# EasyEDA Pro project 8CH_ADC_CAPTURE_CARD.epro, board 8CH_ADC_CARD_V1.3
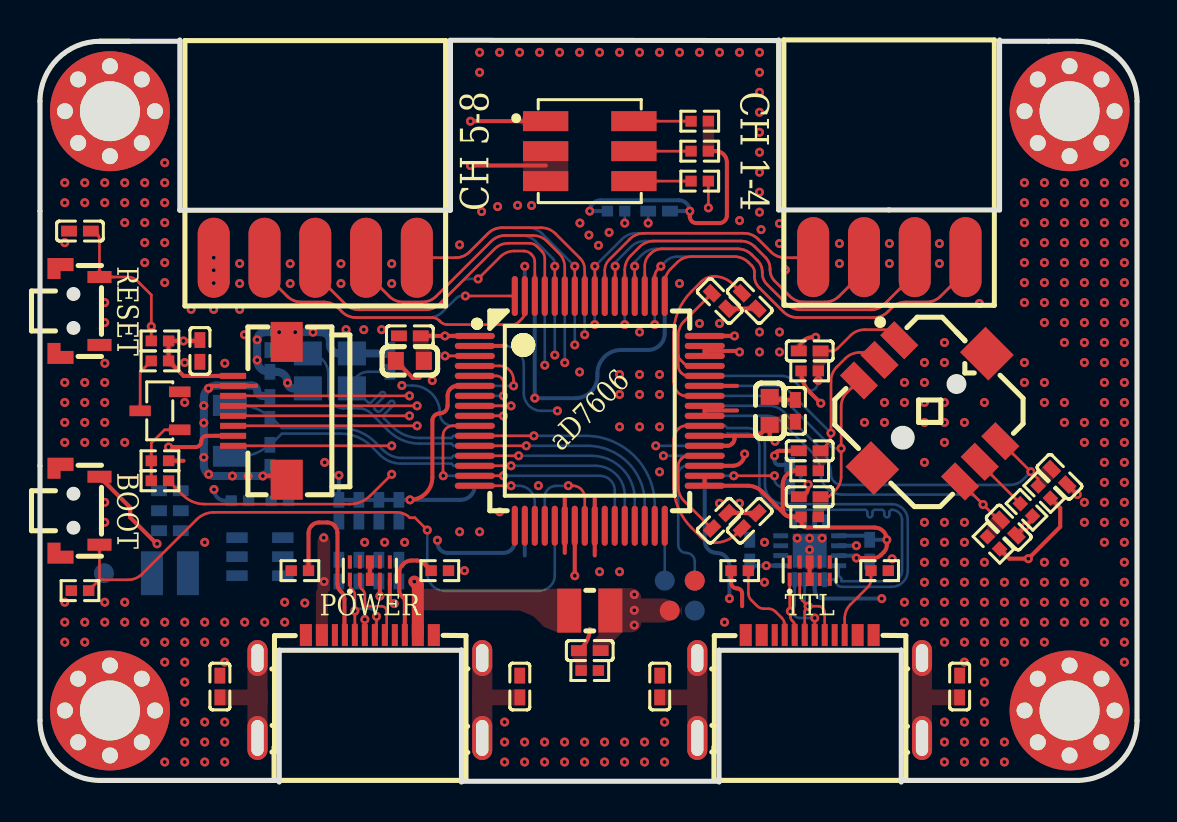
[diagram p10: board, top side]
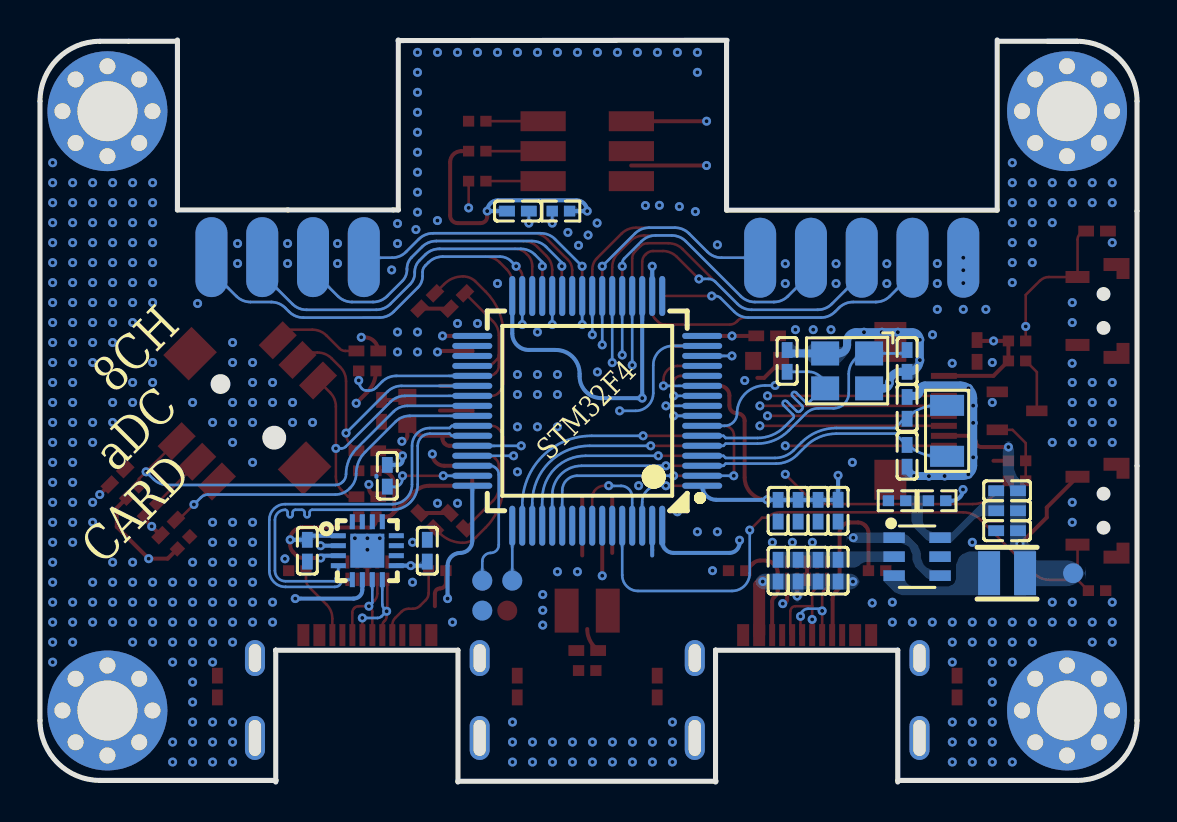
[diagram p11: board, bottom side, seen from below]

Outline 54.87 x 37.15 mm; copper layers: Top Layer, Inner1, Inner2, Bottom Layer. Coordinates in mm from the lower left corner of the outline.
Outline path: 3,37.08 arc(0.88,36.2) 0,34.08 0,3.08 arc(0.88,0.96) 3,0.08 11.97,0.08 ; 3,37.08 4.48,37.08 ; 3,37.08 6.96,37.08 ; 33.97,0.04 21.06,0.04 ; 36.96,37.12 20.5,37.13 ; 48.01,37.08 51.87,37.08 arc(53.99,36.2) 54.87,34.08 54.87,3.08 arc(53.99,0.96) 51.87,0.08 43.06,0.08
Stack: Top Layer 0.035mm 外层铜厚1oz / Dielectric1 0.2104mm 7628 RC49% 8.6mil / Inner1 0.0152mm 内层铜厚 / Dielectric2 1.065mm 1.1mm H/HOZ 含铜 / Inner2 0.0152mm 内层铜厚 / Dielectric3 0.2104mm 7628 RC49% 8.6mil / Bottom Layer 0.035mm 外层铜厚1oz

## Design rules (mm)
net RXD: DP1
net TXD: DP1
net OSC_IN: DP3
net OSC_OUT: DP3
net OSC_32_IN: DP2
net OSC_32_OUT: DP2
net OTG_D+: DP4
net OTG_D-: DP4
template: 自定义配置
spacing copperThickness1oz (default): track to track 0.102, other pairs 0.152 to 0.3
spacing copperThickness2oz: track to track 0.203, other pairs 0.152 to 0.3
spacing SIGNAL: track to track 0.26, other pairs 0.152 to 0.3
track width copperThickness1oz (default): min 0.127, default 0.254, max 2.54
track width copperThickness2oz: min 0.203, default 0.254, max 2.54
track width ADC_CH: min 0.13, default 0.13, max 0.13
track width POWER: min 0.2, default 0.3, max 1
track width SIGNAL: min 0.13, default 0.13, max 0.13
differential pair differentialPair (default): width min 0.127, default 0.254, max 2.54; gap min 0.152, default 0.152
via viaSize (default): diameter min 0.45, default 0.45, max 0.45; hole min 0.2, default 0.2, max 0.2
net NRST uses SIGNAL
net BOOT0 uses SIGNAL
net IPS_SDA uses SIGNAL
net IPS_SCL uses SIGNAL
net DVCC uses POWER
net DGND uses POWER
net IPS_BL uses SIGNAL
net AGND uses POWER
net AVCC uses POWER
net AGND_CH0 uses SIGNAL
net ADC_CH0 uses ADC_CH, SIGNAL
net AGND_CH1 uses SIGNAL
net AGND_CH2 uses SIGNAL
net AGND_CH3 uses SIGNAL
net AGND_CH4 uses SIGNAL
net AGND_CH5 uses SIGNAL
net AGND_CH6 uses SIGNAL
net ADC_CH6 uses ADC_CH, SIGNAL
net AGND_CH7 uses SIGNAL
net ADC_CH7 uses ADC_CH, SIGNAL
net ADC_CH5 uses ADC_CH, SIGNAL
net ADC_CH4 uses ADC_CH, SIGNAL
net ADC_CH3 uses ADC_CH, SIGNAL
net ADC_CH2 uses ADC_CH, SIGNAL
net ADC_CH1 uses ADC_CH, SIGNAL
net ADC_RESET uses SIGNAL
net ADC_CONVST_B uses SIGNAL
net ADC_CONVST_A uses SIGNAL
net ADC_RANGE uses SIGNAL
net ADC_OS2 uses SIGNAL
net ADC_OS1 uses SIGNAL
net ADC_OS0 uses SIGNAL
net IPS_CS uses SIGNAL
net ADC_DB7 uses SIGNAL
net ADC_DB0 uses SIGNAL
net ADC_FRSTDATA uses SIGNAL
net ADC_BUSY uses SIGNAL
net ADC_CS uses SIGNAL
net ADC_RD uses SIGNAL
net RXD uses SIGNAL
net TXD uses SIGNAL
net TTL_D+ uses SIGNAL
net TTL_D- uses SIGNAL
net OSC_IN uses SIGNAL
net OSC_OUT uses SIGNAL
net OSC_32_IN uses SIGNAL
net OSC_32_OUT uses SIGNAL
net UP uses SIGNAL
net PRRESS uses SIGNAL
net LEFT uses SIGNAL
net DOWN uses SIGNAL
net RIGHT uses SIGNAL
net OTG_D+ uses SIGNAL
net OTG_D- uses SIGNAL
net USER uses SIGNAL
net IPS_RESET uses SIGNAL
net IPS_DC uses SIGNAL
net VCC_POWER uses POWER
net SWCLK uses SIGNAL
net SWDIO uses SIGNAL

## Placement (name value [footprint] x y rotation side)
C34  100nF  [C0402]  2 27.58 0 top
C58  12pF  [C0402]  11.5 16.33 90 bottom
C59  12pF  [C0402]  11.5 18.73 270 bottom
C60  10pF  [C0402]  11.5 21.08 270 bottom
C61  10pF  [C0402]  17.5 21.08 270 bottom
C65  100nF  [C0402]  24 4.78 270 top
C72  100nF  [C0402]  38.5 21.58 180 top
C81  4.7uF  [C0402]  30.97 28.58 180 bottom
C103  100nF  [C0402]  8 21.58 270 top
C104  1uF  [C0402]  34 13.08 45 top
C105  1uF  [C0402]  35.5 13.08 45 top
C106  1uF  [C0402]  35.5 24.08 315 top
C107  10uF  [C0402]  34 24.08 315 top
C108  100nF  [C0402]  46 4.78 270 top
C121  100nF  [C0603]  36.5 18.58 270 top
C122  4.7uF  [C0402]  18.5 22.34 0 top
C124  100nF  [C0603]  18.5 21.08 0 top
C130  4.7uF  [C0402]  14.95 13.58 90 bottom
C133  100nF  [C0402]  51 15.28 315 top
C134  100nF  [C0402]  38.5 14.28 180 top
C135  100nF  [C0402]  48.46 12.74 135 top
C136  100nF  [C0402]  38.5 16.58 0 top
C137  4.7uF  [C0402]  37.5 15.33 90 bottom
C138  100nF  [C0402]  35.5 11.58 90 bottom
C139  100nF  [C0402]  41.5 11.58 270 bottom
C151  100nF  [C0402]  14.95 10.58 270 bottom
C152  100nF  [C0402]  15.95 10.58 270 bottom
C153  100nF  [C0402]  16.95 10.58 270 bottom
C154  4.7uF  [C0402]  17.95 10.58 270 bottom
C155  10uF  [C0402]  6.5 12.58 180 bottom
C156  22uF  [C0402]  6.5 14.58 180 bottom
C157  22uF  [C0402]  6.5 13.58 180 bottom
C158  100nF  [C0402]  27.5 6.58 0 top
C165  100nF  [C0402]  15.95 13.58 270 bottom
C166  100nF  [C0402]  16.95 13.58 270 bottom
C167  100nF  [C0402]  17.95 13.58 270 bottom
C168  4.7uF  [C0402]  37.79 18.58 270 top
C169  100nF  [C0402]  9 4.78 270 top
C170  100nF  [C0402]  31 4.78 270 top
FPC1  AFC01-S08FCA-00  [FPC-SMD_P0.50-8P_FGS-XJ-H2.0]  11 18.58 270 top
L1  10uH  [IND-SMD_L2.5-W2.0]  27.5 8.58 0 top
LED6  TC5050RGBF08-3CJH-AF53A  [led-smd_6p-l5.0-w5.0-tl_tc5050rgbf08]  27.5 31.58 0 top
NOREF  -  [Pad_e127]  5.09 5.17 45 top
NOREF#2  -  [Pad_e116]  51.5 31.33 45 top
NOREF#3  -  [Pad_e123]  49.91 1.99 45 top
NOREF#4  -  [Pad_e46]  3.5 31.33 45 top
NOREF#5  -  [Pad_e120]  51.5 5.83 45 top
NOREF#6  -  [Pad_e121]  49.91 5.17 45 top
NOREF#7  -  [Pad_e114]  49.25 33.58 45 top
NOREF#8  -  [Pad_e111]  51.5 35.83 45 top
NOREF#9  -  [Pad_e115]  49.91 31.99 45 top
NOREF#10  -  [Pad_e49]  5.09 31.99 45 top
NOREF#11  -  [Pad_e118]  53.75 3.58 45 top
NOREF#12  -  [Pad_e119]  53.09 5.17 45 top
NOREF#13  -  [Pad_e63]  53.75 33.58 45 top
NOREF#14  -  [Pad_e138]  51.5 3.58 0 top
NOREF#15  -  [Pad_e135]  3.5 1.33 45 top
NOREF#16  -  [Pad_e51]  3.5 35.83 45 top
NOREF#17  -  [Pad_e129]  1.91 5.17 45 top
NOREF#18  -  [Pad_e126]  5.75 3.58 45 top
NOREF#19  -  [Pad_e137]  3.5 3.58 0 top
NOREF#20  -  [Pad_e58]  1.91 35.17 45 top
NOREF#21  -  [Pad_e124]  51.5 1.33 45 top
NOREF#22  -  [Pad_e136]  51.5 33.58 0 top
NOREF#23  -  [Pad_e128]  3.5 5.83 45 top
NOREF#24  -  [Pad_e47]  1.25 33.58 45 top
NOREF#25  -  [Pad_e132]  1.91 1.99 45 top
NOREF#26  -  [Pad_e130]  1.25 3.58 45 top
NOREF#27  -  [Pad_e117]  53.09 31.99 45 top
NOREF#28  -  [Pad_e43]  1.91 31.99 45 top
NOREF#29  -  [Pad_e60]  5.75 33.58 45 top
NOREF#30  -  [Pad_e113]  49.91 35.17 45 top
NOREF#31  -  [Pad_e122]  49.25 3.58 45 top
NOREF#32  -  [Pad_e134]  3.5 33.58 0 top
NOREF#33  -  [Pad_e139]  5.09 1.99 45 top
NOREF#34  -  [Pad_e64]  53.09 35.17 45 top
NOREF#35  -  [Pad_e48]  5.09 35.17 45 top
NOREF#36  -  [Pad_e125]  53.09 1.99 45 top
Q1  S8050  [SOT-23-3_L2.9-W1.3-P1.90-LS2.3-BR]  6 18.58 0 top
R18  10kΩ  [R0402]  2 9.58 180 top
R20  10kΩ  [R0402]  6 22.08 0 top
R77  5.1kΩ  [R0402]  13 10.58 180 top
R78  5.1kΩ  [R0402]  20 10.58 0 top
R79  100Ω  [R0402]  49.34 13.63 135 top
R84  680Ω  [R0402]  33 33.08 0 top
R97  10Ω  [R0402]  6 21.08 0 top
R101  5.1kΩ  [R0402]  35 10.58 180 top
R102  5.1kΩ  [R0402]  42 10.58 0 top
R103  680Ω  [R0402]  33 31.58 0 top
R104  680Ω  [R0402]  33 30.08 0 top
R106  10kΩ  [R0402]  38.5 20.58 180 top
R107  10kΩ  [R0402]  50.23 14.52 315 top
R108  10kΩ  [R0402]  38.5 13.28 180 top
R109  10kΩ  [R0402]  47.69 11.98 315 top
R110  10kΩ  [R0402]  38.5 15.58 180 top
R111  10kΩ  [R0402]  28.82 28.58 180 bottom
R112  0Ω  [R0402]  27.5 5.58 0 top
R113  910kΩ  [R0402]  10 14.08 180 bottom
R114  200kΩ  [R0402]  12 14.08 180 bottom
R115  4.7kΩ  [R0402]  6 15.08 0 top
R116  3.3kΩ  [R0402]  6 16.08 180 top
SW4  TM-4175-B-B  [SW-SMD_TM-4175-B-X]  44.5 18.58 315 top
SW5  TS24CA  [SW-SMD_TS24CA]  2 23.58 90 top
SW6  TS24CA  [SW-SMD_TS24CA]  2 13.58 90 top
U20  CH343P  [TQFN-16_L3.0-W3.0-P0.50-BL-EP1.7]  38.5 11.58 270 bottom
U27  TLV62569PDDCR  [SOT-23-6_L2.9-W1.6-P0.95-LS2.8-BL]  11 11.28 270 bottom
U29  AD7606BSTZ  [LQFP-64_L10.0-W10.0-P0.50-LS12.0-BL]  27.5 18.58 270 top
U33  2.54-2*4  [HDR-TH_8P-P2.54-V-F-R2-C4-S2.54]  42.49 26.28 0 top
U35  STM32F405RGT6  [LQFP-64_L10.0-W10.0-P0.50-LS12.0-BL]  27.5 18.58 90 bottom
U37  RCLAMP0524P-ES  [DFN2510-10_L2.5-W1.0-P0.50-BL]  16.5 10.58 0 top
U38  RCLAMP0524P-ES  [DFN2510-10_L2.5-W1.0-P0.50-BL]  38.5 10.58 0 top
U46  2.2uH  [IND-SMD_L2.5-W2.0-B]  6.5 10.45 180 bottom
U47  2.54-2*5  [HDR-TH_10P-P2.54-V-F-R2-C5-S2.54]  13.77 26.25 0 top
U48  -  [焊盘]  31.25 10.08 180 bottom
U49  -  [焊盘]  32.75 10.08 180 bottom
U50  -  [焊盘]  32.75 8.58 180 bottom
U51  -  [焊盘]  3.2 10.45 180 bottom
U52  -  [焊盘]  32.75 10.08 0 top
U53  -  [焊盘]  31.5 8.58 0 top
USB2  TYPEC-302-BRP16SC16  [USB-C-SMD_TYPEC-302-BRP16SC16]  16.5 4.78 0 top
USB3  TYPEC-302-BRP16SC16  [USB-C-SMD_TYPEC-302-BRP16SC16]  38.5 4.78 0 top
X1  8MHz  [OSC-SMD_4P-L3.2-W2.5-BL]  14.5 20.58 0 bottom
X2  32.768kHz  [OSC-SMD_L3.2-W1.5]  9.5 17.58 90 bottom

## Footprints (pads in the part's own frame, mm; a bottom-side part is the same pattern mirrored in y, then rotated)
C0402
  rect 0.79x0.54 smd: 1(-0.545,0) 2(0.545,0)
C0603
  rect 0.8x0.9 smd: 1(-0.7,0) 2(0.7,0)
DFN2510-10_L2.5-W1.0-P0.50-BL
  rect 0.2x0.665 smd: 1(-1,-0.433) 2(-0.5,-0.433) 4(0.5,-0.433) 5(1,-0.433) 6(1,0.433) 7(0.5,0.433) 9(-0.5,0.433) 10(-1,0.433)
  rect 0.4x0.665 smd: 3(0,-0.433) 8(0,0.433)
FPC-SMD_P0.50-8P_FGS-XJ-H2.0
  rect 0.3x1.3 smd: 1(-1.75,-1.34) 2(-1.252,-1.339) 3(-0.75,-1.34) 4(-0.25,-1.34) 5(0.25,-1.34) 6(0.75,-1.34) 7(1.25,-1.34) 8(1.75,-1.34)
  rect 2x1.6 smd: 9(3.45,1.34) 10(-3.45,1.34)
HDR-TH_8P-P2.54-V-F-R2-C4-S2.54
  oval 1.6x4 smd: 1(-3.81,0) 3(-1.27,0) 5(1.27,0) 7(3.81,0)
  oval 1.6x4 smd far side: 2(-3.81,0) 4(-1.27,0) 6(1.27,0) 8(3.81,0)
HDR-TH_10P-P2.54-V-F-R2-C5-S2.54
  oval 1.6x4 smd: 1(-5.08,0) 3(-2.54,0) 5(0,0) 7(2.54,0) 9(5.08,0)
  oval 1.6x4 smd far side: 2(-5.08,0) 4(-2.54,0) 6(0,0) 8(2.54,0) 10(5.08,0)
IND-SMD_L2.5-W2.0
  rect 1.2x2.2 smd: 1(1.028,0) 2(-1.028,0)
IND-SMD_L2.5-W2.0-B
  rect 1.1x2.2 smd: 1(-0.9,0) 2(0.9,0)
led-smd_6p-l5.0-w5.0-tl_tc5050rgbf08
  rect 2.265x1 smd: 1(-2.208,1.5) 2(-2.208,0) 3(-2.208,-1.5) 4(2.208,-1.5) 5(2.208,0) 6(2.208,1.5)
LQFP-64_L10.0-W10.0-P0.50-LS12.0-BL
  oval 0.3x2 smd: 1(-3.75,-5.75) 2(-3.25,-5.75) 3(-2.75,-5.75) 4(-2.25,-5.75) 5(-1.75,-5.75) 6(-1.25,-5.75) 7(-0.75,-5.75) 8(-0.25,-5.75) 9(0.25,-5.75) 10(0.75,-5.75) 11(1.25,-5.75) 12(1.75,-5.75) 13(2.25,-5.75) 14(2.75,-5.75) 15(3.25,-5.75) 16(3.75,-5.75) 33(3.75,5.75) 34(3.25,5.75) 35(2.75,5.75) 36(2.25,5.75) 37(1.75,5.75) 38(1.25,5.75) 39(0.75,5.75) 40(0.25,5.75) 41(-0.25,5.75) 42(-0.75,5.75) 43(-1.25,5.75) 44(-1.75,5.75) 45(-2.25,5.75) 46(-2.75,5.75) 47(-3.25,5.75) 48(-3.75,5.75)
  oval 2x0.3 smd: 17(5.75,-3.75) 18(5.75,-3.25) 19(5.75,-2.75) 20(5.75,-2.25) 21(5.75,-1.75) 22(5.75,-1.25) 23(5.75,-0.75) 24(5.75,-0.25) 25(5.75,0.25) 26(5.75,0.75) 27(5.75,1.25) 28(5.75,1.75) 29(5.75,2.25) 30(5.75,2.75) 31(5.75,3.25) 32(5.75,3.75) 49(-5.75,3.75) 50(-5.75,3.25) 51(-5.75,2.75) 52(-5.75,2.25) 53(-5.75,1.75) 54(-5.75,1.25) 55(-5.75,0.75) 56(-5.75,0.25) 57(-5.75,-0.25) 58(-5.75,-0.75) 59(-5.75,-1.25) 60(-5.75,-1.75) 61(-5.75,-2.25) 62(-5.75,-2.75) 63(-5.75,-3.25) 64(-5.75,-3.75)
OSC-SMD_4P-L3.2-W2.5-BL
  rect 1.4x1.2 smd: 1(-1.1,-0.875) 2(1.1,-0.875) 3(1.1,0.875) 4(-1.1,0.875)
OSC-SMD_L3.2-W1.5
  rect 1.05x1.7 smd: 1(-1.275,0) 2(1.275,0)
Pad_e43
  round 1.3 hole 0.8: 1(0,0)
Pad_e46
  round 1.3 hole 0.8: 1(0,0)
Pad_e47
  round 1.3 hole 0.8: 1(0,0)
Pad_e48
  round 1.3 hole 0.8: 1(0,0)
Pad_e49
  round 1.3 hole 0.8: 1(0,0)
Pad_e51
  round 1.3 hole 0.8: 1(0,0)
Pad_e58
  round 1.3 hole 0.8: 1(0,0)
Pad_e60
  round 1.3 hole 0.8: 1(0,0)
Pad_e63
  round 1.3 hole 0.8: 1(0,0)
Pad_e64
  round 1.3 hole 0.8: 1(0,0)
Pad_e111
  round 1.3 hole 0.8: 1(0,0)
Pad_e113
  round 1.3 hole 0.8: 1(0,0)
Pad_e114
  round 1.3 hole 0.8: 1(0,0)
Pad_e115
  round 1.3 hole 0.8: 1(0,0)
Pad_e116
  round 1.3 hole 0.8: 1(0,0)
Pad_e117
  round 1.3 hole 0.8: 1(0,0)
Pad_e118
  round 1.3 hole 0.8: 1(0,0)
Pad_e119
  round 1.3 hole 0.8: 1(0,0)
Pad_e120
  round 1.3 hole 0.8: 1(0,0)
Pad_e121
  round 1.3 hole 0.8: 1(0,0)
Pad_e122
  round 1.3 hole 0.8: 1(0,0)
Pad_e123
  round 1.3 hole 0.8: 1(0,0)
Pad_e124
  round 1.3 hole 0.8: 1(0,0)
Pad_e125
  round 1.3 hole 0.8: 1(0,0)
Pad_e126
  round 1.3 hole 0.8: 1(0,0)
Pad_e127
  round 1.3 hole 0.8: 1(0,0)
Pad_e128
  round 1.3 hole 0.8: 1(0,0)
Pad_e129
  round 1.3 hole 0.8: 1(0,0)
Pad_e130
  round 1.3 hole 0.8: 1(0,0)
Pad_e132
  round 1.3 hole 0.8: 1(0,0)
Pad_e134
  round 6 hole 3: 101(0,0)
Pad_e135
  round 1.3 hole 0.8: 1(0,0)
Pad_e136
  round 6 hole 3: 101(0,0)
Pad_e137
  round 6 hole 3: 101(0,0)
Pad_e138
  round 6 hole 3: 101(0,0)
Pad_e139
  round 1.3 hole 0.8: 1(0,0)
R0402
  rect 0.566x0.54 smd: 1(-0.433,0) 2(0.433,0)
SOT-23-3_L2.9-W1.3-P1.90-LS2.3-BR
  rect 1.07x0.532 smd: 1(0.99,-0.95) 2(0.99,0.95) 3(-0.99,0)
SOT-23-6_L2.9-W1.6-P0.95-LS2.8-BL
  rect 0.532x1.072 smd: 1(-0.95,-1.149) 2(0,-1.149) 3(0.95,-1.149) 4(0.95,1.149) 5(0,1.149) 6(-0.95,1.149)
SW-SMD_TM-4175-B-X
  rect 1.7x1 smd: 1(-3.575,1.425) 2(-3.575,0.028) 3(-3.575,-1.425) 4(3.575,1.425) 5(3.575,-0.028) 6(3.575,-1.425)
  rect 2x1.8 smd: 7(0,4.05) 7(0,-4.05)
SW-SMD_TS24CA
  custom 1.05x1.3 smd: 1(-2.125,0.975) 2(2.125,0.975)
  rect 0.6x1.2 smd: 3(-1.7,-0.975) 4(1.7,-0.975)
TQFN-16_L3.0-W3.0-P0.50-BL-EP1.7
  rect 0.25x0.75 smd: 1(-0.749,-1.45) 2(-0.248,-1.45) 3(0.252,-1.45) 4(0.751,-1.45) 9(0.75,1.45) 10(0.25,1.45) 11(-0.25,1.45) 12(-0.749,1.45)
  rect 0.75x0.25 smd: 5(1.45,-0.75) 6(1.45,-0.25) 7(1.45,0.25) 8(1.45,0.75) 13(-1.45,0.75) 14(-1.45,0.25) 15(-1.45,-0.25) 16(-1.45,-0.75)
  rect 1.7x1.7 smd: 17(0.001,0)
USB-C-SMD_TYPEC-302-BRP16SC16
  rect 0.6x1.1 smd: 1(-3.2,2.575) 2(-2.4,2.575) 11(2.4,2.575) 12(3.2,2.575)
  rect 0.3x1.1 smd: 3(-1.75,2.575) 4(-1.25,2.575) 5(-0.75,2.575) 6(-0.25,2.575) 7(0.25,2.575) 8(0.75,2.575) 9(1.25,2.575) 10(1.75,2.575)
  oval 1x1.8 hole 0.61x1.4: 13(-5.62,1.425) 14(5.62,1.425)
  oval 1x2.2 hole 0.61x1.8: 15(-5.62,-2.575) 16(5.62,-2.575)
焊盘
  round 1 smd: 1(0,0)

## Nets
As in the schematic, except:
AGND: C104.2 C105.2 C106.2 C107.2 C121.1 C122.1 C124.1 C158.1 C168.1 R112.1 U29.2 U29.17 U29.18 U29.19 U29.20 U29.21 U29.22 U29.25 U29.26 U29.27 U29.28 U29.29 U29.30 U29.31 U29.32 U29.35 U29.40 U29.41 U29.43 U29.46 U29.47 U47.1 U47.2 U52.1
AVCC: C121.2 C122.2 C124.2 C158.2 C168.2 L1.1 LED6.1 U29.1 U29.37 U29.38 U29.48 U53.1
DGND: C34.1 C58.1 C59.1 C60.2 C61.1 C65.1 C72.2 C81.1 C103.2 C108.1 C130.1 C133.2 C134.2 C135.1 C136.1 C137.2 C138.2 C139.2 C151.1 C152.1 C153.1 C154.1 C155.1 C165.2 C166.2 C167.2 C169.1 C170.1 FPC1.2 FPC1.9 FPC1.10 Q1.2 R18.2 R77.2 R78.2 R79.1 R84.2 R101.2 R102.2 R103.2 R111.2 R112.2 R114.1 R116.1 SW5.1 SW5.2 SW5.3 SW6.1 SW6.2 U20.2 U20.17 U27.2 U35.18 U35.63 U37.3 U37.8 U38.3 U38.8 U50.1 USB2.1 USB2.12 USB3.1 USB3.12 X1.2 X1.4
DVCC: C103.1 C130.2 C138.1 C139.1 C155.2 C156.2 C157.2 C165.1 C166.1 C167.1 FPC1.1 FPC1.7 LED6.2 LED6.3 R20.2 R97.2 R106.2 R107.2 R108.2 R109.2 R110.2 R113.2 SW6.4 U20.1 U20.3 U20.6 U20.9 U29.6 U29.23 U29.33 U29.34 U35.1 U35.19 U35.32 U35.48 U35.64 U37.5 U46.2 U51.1
SWCLK: U35.49 U48.1
SWDIO: U35.46 U49.1

Pads without a net: NOREF 1; NOREF#2 1; NOREF#3 1; NOREF#4 1; NOREF#5 1; NOREF#6 1; NOREF#7 1; NOREF#8 1; NOREF#9 1; NOREF#10 1; NOREF#11 1; NOREF#12 1; NOREF#13 1; NOREF#14 101; NOREF#15 1; NOREF#16 1; NOREF#17 1; NOREF#18 1; NOREF#19 101; NOREF#20 1; NOREF#21 1; NOREF#22 101; NOREF#23 1; NOREF#24 1; NOREF#25 1; NOREF#26 1; NOREF#27 1; NOREF#28 1; NOREF#29 1; NOREF#30 1; NOREF#31 1; NOREF#32 101; NOREF#33 1; NOREF#34 1; NOREF#35 1; NOREF#36 1; SW4 7; U20 10 11 12 13 14 15 16; U27 5; U29 7; U35 12 13 26 27 29 30 33 34 35 36 55 56 57 58 59; U37 6 7 9 10; U38 4 5 6 7 9 10; USB2 3 9; USB3 2 3 9 11

## Via types
v1: diameter 0.45, hole 0.2, Top Layer to Bottom Layer, 490 vias

## Routing (per net, layer and track width the routed paths; a pad name or vN(x,y) marks a point on that pad's centre or on a via; arc(x,y) is an arc through that point)
AGND: length 22.6
  Top Layer w0.2: C158.1 27.12,6.75 arc(27.4,7.17) 27.5,7.66 ; 33.25,21.58 34.87,21.58 ; 33.25,21.58 U29.46 ; 33.25,21.58 U29.47 ; 26.25,11.47 U29.22 26.25,14.26 ; 27.75,11.34 U29.25 27.75,14.26 ; U29.35 34.66,15.83 arc(35.07,16.01) v1(35.25,16.42) ; C124.1 18.65,20.23 18.99,20.23 ; C107.2 C106.2 ; U29.2 23.31,21.83 ; U29.43 34.87,19.83 ; C104.2 C105.2 ; 33.25,18.6 34.87,18.6 ; 33.25,18.6 U29.41 ; 33.25,18.6 U29.40 ; C168.1 36.66,19.13 arc(36.55,19.17) C121.1
  vias: v1(7.56,23.66) v1(8.69,26.25) v1(8.69,25.62) v1(8.69,24.98) v1(8.69,23.66) v1(9.99,25.96) v1(9.99,24.96) v1(9.99,23.66) v1(12.51,25.95) v1(12.51,24.95) v1(15.05,25.95) v1(15.05,24.95) v1(15.31,22.65) v1(16.2,22.65) v1(17.09,22.65) v1(17.59,25.95) v1(17.59,24.95) v1(19.62,20.1) v1(20.99,26.89) v1(20.99,12.53) v1(21.99,36.53) v1(21.99,35.53) v1(21.99,12.53) v1(22.09,28.56) v1(22.89,28.81) v1(22.99,36.53) v1(22.99,13.53) v1(23.89,28.87) v1(23.99,36.53) v1(24.59,28.86) v1(24.93,14.84) v1(24.99,36.53) v1(25.99,36.53) v1(26.99,36.53) v1(27.01,27.98) v1(26.99,20.53) v1(27.46,27.38) v1(27.94,26.87) v1(27.99,36.53) v1(27.99,10.53) v1(28.47,27.51) v1(28.99,36.53) v1(28.99,20.4) v1(28.99,19.4) v1(28.99,17.78) v1(28.99,10.53) v1(29.99,36.53) v1(29.99,22.53) v1(29.99,20.4) v1(29.99,19.4) v1(29.99,17.78) v1(30.99,36.53) v1(30.99,20.4) v1(30.99,19.4) v1(30.99,17.78) v1(30.99,15.53) v1(31.99,36.53) v1(31.99,24.96) v1(32.99,36.53) v1(32.99,22.96) v1(33.99,36.53) v1(33.99,22.96) v1(33.99,13.96) v1(34.99,36.53) v1(34.99,28.11) v1(34.99,21.53) v1(34.99,13.96) v1(35.99,36.53) v1(35.99,35.53) v1(35.99,34.53) v1(35.99,33.53) v1(35.99,32.53) v1(35.99,31.53) v1(35.99,30.53) v1(35.99,29.53) v1(35.99,28.53) v1(35.99,22.53) v1(35.99,21.53) v1(36.07,27.66) v1(36.99,27.96) v1(36.99,26.96) v1(36.99,22.53) v1(36.99,21.53) v1(37.28,25.64) v1(39.99,26.96) v1(39.99,25.96) v1(42.49,26.96) v1(42.49,25.96) v1(44.99,26.96) v1(44.99,25.96) v1(46.99,23.96)
AGND_CH0: length 20.1
  Top Layer w0.13: U29.50 30.75,25.31 arc(30.79,25.5) 30.89,25.66 v1(31.06,25.82)
  Bottom Layer w0.13: v1(31.06,25.82) 31.31,26.07 arc(31.56,26.24) 31.86,26.3 34.74,26.3 arc(35.12,26.23) 35.44,26.01 35.61,25.85 arc(35.7,25.7) 35.74,25.53 35.74,25.32 arc(35.8,25.02) 35.97,24.76 37.18,23.54 arc(37.51,23.33) 37.89,23.25 41.7,23.25 arc(42.08,23.33) 42.41,23.54 42.6,23.74 arc(42.93,23.95) 43.31,24.03 44.34,24.03 arc(44.73,24.11) 45.05,24.32 46.31,25.58 46.31,26.25
AGND_CH1: length 19
  Top Layer w0.13: v1(29.74,25.82) 29.74,24.34 U29.52
  Bottom Layer w0.13: 43.77,26.25 43.77,25.45 42.25,23.93 arc(41.92,23.72) 41.54,23.64 38.05,23.64 arc(37.67,23.72) 37.34,23.93 36.36,24.92 arc(36.19,25.18) 36.13,25.48 36.13,25.54 arc(36.07,25.85) 35.89,26.11 35.6,26.4 arc(35.28,26.62) 34.9,26.69 30.82,26.69 arc(30.44,26.62) 30.11,26.4 29.74,26.03 v1(29.74,25.82)
AGND_CH2: length 17.3
  Top Layer w0.13: U29.54 28.77,24.35 v1(28.77,25.82)
  Bottom Layer w0.13: 41.23,26.25 41.23,25.58 39.97,24.32 arc(39.65,24.11) 39.26,24.03 38.21,24.03 arc(37.83,24.11) 37.51,24.32 36.75,25.08 arc(36.58,25.34) 36.52,25.64 36.52,25.7 arc(36.46,26.01) 36.28,26.27 35.76,26.79 arc(35.44,27.01) 35.06,27.08 30.26,27.08 arc(29.88,27.01) 29.55,26.79 28.77,26 v1(28.77,25.82)
AGND_CH3: length 13.5
  Top Layer w0.13: v1(27.75,25.82) 27.75,24.34 U29.56
  Bottom Layer w0.13: 38.69,26.25 37.27,26.25 arc(36.89,26.32) 36.56,26.54 35.92,27.18 arc(35.6,27.4) 35.21,27.47 29.82,27.47 arc(29.44,27.4) 29.11,27.18 v1(27.75,25.82)
AGND_CH4: length 10.7
  Top Layer w0.13: U29.58 v1(26.75,25.82)
  Bottom Layer w0.13: U47.10 20.78,26.25 arc(21.16,26.32) 21.49,26.54 22.41,27.46 arc(22.73,27.68) 23.11,27.75 24.41,27.75 arc(24.79,27.67) 25.11,27.46 v1(26.75,25.82)
AGND_CH5: length 14.3
  Top Layer w0.13: U29.60 v1(25.75,25.82)
  Bottom Layer w0.13: v1(25.75,25.82) 25.75,25.97 arc(25.72,26.1) 25.65,26.2 24.79,27.07 arc(24.46,27.29) 24.08,27.36 23.27,27.36 arc(22.89,27.29) 22.57,27.07 19.82,24.32 arc(19.5,24.11) 19.11,24.03 18.17,24.03 arc(17.78,24.11) 17.46,24.32 16.3,25.48 16.3,26.25
AGND_CH6: length 15.6
  Top Layer w0.13: v1(21.91,25.19) 23.02,26.29 arc(23.34,26.51) 23.72,26.58 24.2,26.58 arc(24.39,26.54) 24.56,26.44 24.6,26.39 arc(24.71,26.23) 24.75,26.04 U29.62
  Bottom Layer w0.13: v1(21.91,25.19) 21.44,25.19 arc(21.25,25.15) 21.09,25.04 19.98,23.93 arc(19.66,23.72) 19.28,23.64 15.97,23.64 arc(15.59,23.72) 15.27,23.93 13.77,25.43 U47.6
AGND_CH7: length 14.5
  Top Layer w0.13: v1(21.28,24.33) U29.64
  Bottom Layer w0.13: v1(21.28,24.33) 21.07,24.33 arc(20.94,24.31) 20.83,24.23 20.14,23.54 arc(19.82,23.33) 19.44,23.25 15.81,23.25 arc(15.43,23.33) 15.1,23.54 14.91,23.74 arc(14.59,23.95) 14.2,24.03 13.07,24.03 arc(12.69,24.11) 12.36,24.32 11.23,25.45 U47.4
AVCC: length 14.2
  Top Layer w0.2: U29.1 v1(20.26,22.33) 19.05,22.33 arc(19.05,22.33) C122.2 ; U29.37 34.39,16.83 arc(34.5,16.85) 34.6,16.92 34.65,16.97 arc(34.72,17.07) 34.74,17.18 34.74,17.33 34.74,17.33 ; U29.38 34.74,17.33 ; 34.74,17.33 35.69,17.33 arc(35.93,17.38) 36.14,17.52 C121.2 36.5,17.33 arc(36.58,17.14) v1(36.77,17.06) ; v1(21.53,33.08) LED6.1 ; v1(34.74,22.33) U29.48
  vias: v1(29.73,9.38) v1(29.73,8.6) v1(29.73,7.86)
DGND: length 79.7
  Top Layer w0.2: R116.1 7.18,16.08 ; U38.3 U38.8 ; R79.1 49.65,13.16 v1(49.29,12.8) C135.1 ; 35.12,8.8 35.12,9.44 arc(35.05,9.62) 34.87,9.69 arc(34.65,9.78) 34.57,9.99 R101.2 ; C133.2 v1(51.88,14.39) ; v1(32.5,28.58) 32.5,28.31 arc(32.6,28.08) 32.83,27.98 33.98,27.98 arc(34.25,28.09) 34.36,28.36 34.36,31.03 arc(34.2,31.42) 33.8,31.58 R103.2 ; v1(38.42,14.9) 38.42,14.75 arc(38.29,14.42) C134.2 ; v1(11.15,15.32) 12.15,15.32 arc(12.28,15.27) FPC1.9 ; C136.1 36.99,16.58 arc(36.81,16.51) v1(36.74,16.33) ; v1(38.8,22.27) 38.64,22.27 arc(38.16,22.06) C72.2 ; U37.3 U37.8 ; v1(8.43,19.71) arc(8.46,19.8) 8.55,19.83 FPC1.2 10.8,19.83 arc(10.81,19.84) 10.82,19.85
  Inner2 w0.2: v1(6.24,28) 24.38,28 24.38,28 ; v1(24.25,25.82) 24.25,27.47 arc(24.26,27.61) 24.28,27.74 arc(24.31,27.84) 24.36,27.95 arc(24.77,28.41) 25.36,28.58 v1(27.5,28.58)
  Bottom Layer w0.2: U20.2 v1(40.84,11.83) ; v1(36.74,16.33) 36.74,16.09 arc(36.8,15.94) 36.95,15.88 C137.2 ; C81.1 v1(32.5,28.58) arc(32.5,28.6) 32.5,28.61 ; 38.04,15.33 38.04,15.28 ; U35.63 24.25,11.34 ; R111.2 v1(27.5,28.58) arc(27.66,28.96) 28.04,29.12 31.96,29.12 arc(32.34,28.97) 32.5,28.61 ; v1(24.25,25.82) U35.18 ; 32.5,28.61 arc(32.5,28.61) 32.5,28.61
  Bottom Layer w0.4: X1.4 12.66,19.71 arc(12.47,19.79) v1(12.39,19.98) arc(12.22,20.37) 11.83,20.54 C60.2 11.45,20.54 arc(11.03,20.71) v1(10.86,21.12) v1(10.86,22.14) arc(10.97,22.41) 11.24,22.52 v1(11.96,22.52) v1(12.77,22.52) v1(13.66,22.52) 14.05,22.52 arc(14.37,22.39) 14.5,22.07 14.5,21.88 arc(14.63,21.58) 14.93,21.46 X1.2 17.33,21.46 arc(17.45,21.51) C61.1 ; 11.5,19.33 11.13,19.33 arc(10.94,19.41) 10.86,19.6 arc(10.79,19.78) 10.61,19.85 8.83,19.85 arc(8.62,19.81) v1(8.43,19.71) arc(8.26,19.49) 8.2,19.22 v1(8.2,18.84) v1(8.2,17.98) v1(8.2,16.26) 8.2,15.85 arc(8.26,15.6) v1(8.44,15.41) arc(8.58,15.34) 8.73,15.32 v1(9.62,15.32) 10.98,15.32 arc(11.35,15.47) 11.5,15.83
  vias: v1(1.24,30) v1(1.24,29) v1(1.24,27) v1(1.24,20) v1(1.24,19) v1(1.24,18) v1(1.24,17) v1(1.24,9) v1(1.24,8) v1(1.24,7) v1(2.24,30) v1(2.24,29) v1(2.24,20) v1(2.24,19) v1(2.24,18) v1(2.24,17) v1(2.24,8) v1(2.24,7) v1(3.24,30) v1(3.24,29) v1(3.24,24) v1(3.24,23) v1(3.25,20.96) v1(3.24,20) v1(3.24,19) v1(3.24,18) v1(3.24,17) v1(3.24,14) v1(3.24,13) v1(3.24,9) v1(3.24,8) v1(4.24,30) v1(4.24,29) v1(4.24,28) v1(4.24,17) v1(4.24,9) v1(4.24,8) v1(5.24,30) v1(5.24,29) v1(5.24,28) v1(5.24,27) v1(5.24,26) v1(5.24,8) v1(5.24,7) v1(6.24,31) v1(6.24,30) v1(6.24,29) v1(6.24,27) v1(6.24,26) v1(6.24,25) v1(6.24,8) v1(6.24,7) v1(6.24,6) v1(6.24,1) v1(7.24,21) v1(7.24,19) v1(7.24,8) v1(7.24,7) v1(7.24,6) v1(7.24,5) v1(7.24,4) v1(7.24,3) v1(7.24,2) v1(7.24,1) v1(8.24,12) v1(8.24,8) v1(8.24,7) v1(8.24,3) v1(8.24,2) v1(8.24,1) v1(9.25,20.96) v1(9.24,8) v1(9.24,7) v1(9.24,6) v1(9.24,3) v1(9.24,2) v1(9.24,1) v1(10.23,22.39) v1(10.24,8) v1(10.41,15.31) v1(11.24,8) v1(12.24,9) v1(12.24,8) v1(13.25,8.96) v1(14.24,16) v1(16.24,12) v1(17.24,12) v1(18.24,12) v1(21.23,10.58) v1(23.24,3) v1(23.24,2) v1(23.24,1) v1(24.24,2) v1(24.24,1) v1(25.24,2) v1(25.24,1) v1(26.24,2) v1(26.24,1) v1(27.24,2) v1(27.24,1) v1(28.24,2) v1(28.24,1) v1(29.24,2) v1(29.24,1) v1(30.24,2) v1(30.24,1) v1(31.24,3) v1(31.24,2) v1(31.24,1) v1(34.24,8) v1(36.24,12) v1(36.24,10) v1(37.88,12.21) v1(38.5,12.21) v1(38.5,11.63) v1(39.12,12.21) v1(41.24,18) v1(42.24,19) v1(42.24,18) v1(42.62,11.18) v1(43.24,20) v1(43.24,19) v1(43.24,9) v1(43.24,8) v1(44.24,21) v1(44.24,20) v1(44.24,19) v1(44.24,18) v1(44.24,16) v1(44.24,13) v1(44.24,12) v1(44.24,11) v1(44.24,10) v1(44.24,9) v1(44.24,8) v1(45.24,22) v1(45.24,21) v1(45.24,19) v1(45.24,18) v1(45.24,17) v1(45.24,13) v1(45.24,12) v1(45.24,11) v1(45.24,10) v1(45.24,9) v1(45.24,8) v1(45.24,7) v1(45.24,3) v1(45.24,2) v1(45.24,1) v1(46.24,18) v1(46.24,13) v1(46.24,12) v1(46.24,11) v1(46.24,10) v1(46.24,9) v1(46.24,8) v1(46.24,7) v1(46.24,6) v1(46.24,3) v1(46.24,2) v1(46.24,1) v1(47.24,19) v1(47.24,11) v1(47.24,10) v1(47.24,9) v1(47.24,8) v1(47.24,7) v1(47.24,6) v1(47.24,5) v1(47.24,4) v1(47.24,3) v1(47.24,2) v1(47.24,1) v1(48.24,10) v1(48.24,9) v1(48.24,8) v1(48.24,7) v1(48.24,6) v1(48.24,2) v1(48.24,1) v1(49.24,30) v1(49.24,29) v1(49.24,28) v1(49.24,27) v1(49.24,26) v1(49.24,25) v1(49.24,24) v1(49.24,21) v1(49.24,20) v1(49.24,10) v1(49.24,9) v1(49.24,8) v1(49.24,7) v1(50.24,30) v1(50.24,29) v1(50.24,28) v1(50.24,27) v1(50.24,26) v1(50.24,25) v1(50.24,24) v1(50.24,23) v1(50.24,20) v1(50.24,19) v1(50.24,11) v1(50.24,10) v1(50.24,9) v1(50.24,8) v1(50.24,7) v1(51.24,30) v1(51.24,29) v1(51.24,28) v1(51.24,27) v1(51.24,26) v1(51.24,25) v1(51.24,24) v1(51.24,23) v1(51.24,22) v1(51.24,19) v1(51.24,18) v1(51.24,11) v1(51.24,10) v1(51.24,9) v1(51.24,8) v1(52.24,30) v1(52.24,29) v1(52.24,28) v1(52.24,27) v1(52.24,26) v1(52.24,25) v1(52.24,24) v1(52.24,23) v1(52.24,22) v1(52.24,21) v1(52.24,18) v1(52.24,17) v1(52.24,14) v1(52.24,13) v1(52.24,10) v1(52.24,9) v1(52.24,8) v1(53.24,30) v1(53.24,29) v1(53.24,28) v1(53.24,27) v1(53.24,26) v1(53.24,25) v1(53.24,24) v1(53.24,23) v1(53.24,22) v1(53.24,21) v1(53.24,20) v1(53.24,19) v1(53.24,18) v1(53.24,17) v1(53.24,16) v1(53.24,15) v1(53.24,14) v1(53.24,13) v1(53.24,12) v1(53.24,9) v1(53.24,8) v1(53.24,7) v1(54.24,31) v1(54.24,30) v1(54.24,29) v1(54.24,28) v1(54.24,27) v1(54.24,26) v1(54.24,25) v1(54.24,24) v1(54.24,23) v1(54.24,22) v1(54.24,21) v1(54.24,20) v1(54.24,19) v1(54.24,18) v1(54.24,17) v1(54.24,16) v1(54.24,15) v1(54.24,14) v1(54.24,13) v1(54.24,12) v1(54.24,11) v1(54.24,10) v1(54.24,9) v1(54.24,8) v1(54.24,7) v1(54.24,6)
DVCC: length 132.1
  Top Layer w0.2: U29.6 20.88,19.83 arc(20.53,19.69) 20.39,19.34 20.39,18.85 arc(20.27,18.57) 20,18.45 arc(19.73,18.35) 19.63,18.09 19.63,15.25 arc(19.3,14.46) v1(18.51,14.13) ; 37.55,13.28 R108.2 38.07,13.09 arc(38.17,12.84) 38.42,12.74 41.75,12.74 arc(42.18,12.56) v1(42.36,12.13) 42.36,11.87 arc(42.32,11.68) 42.21,11.51 42.06,11.36 arc(41.9,11.25) 41.71,11.22 v1(40.84,11.22) ; 37.55,13.28 arc(37.27,13.4) 37.15,13.68 37.15,14.9 arc(37.35,15.38) 37.84,15.58 R110.2 ; 37.55,13.28 arc(37.39,13.32) 37.24,13.41 36.12,14.54 arc(35.79,14.76) 35.41,14.83 U29.33 U29.34 ; v1(39.06,18.96) 38.51,19.51 arc(38.18,20) R106.2 ; FPC1.7 8.34,17.33 arc(8.15,17.25) 8.07,17.06 arc(7.98,16.85) 7.78,16.77 v1(6.43,16.77) ; 25.3,30.86 v1(21.53,30.86) ; FPC1.1 7.18,20.33 R97.2 R20.2 v1(7.18,22.08) 7.96,22.08 C103.1 ; R109.2 48.49,11.18 v1(49.44,11.18) 51.03,12.78 51.03,13.72 R107.2 ; SW6.4 4.51,13.74 4.51,13.25 5.83,11.93 v1(5.86,11.93) ; U37.5 17.5,9.15 arc(17.56,8.99) v1(17.72,8.93) ; U29.23 v1(26.75,10.33)
  Inner1 w0.2: 24.2,7.79 24.21,7.79 v1(26.75,10.33) ; v1(21.53,30.86) 21.53,28.87 arc(21.26,28.22) 20.61,27.95 7.53,27.95 arc(7.1,27.77) 6.93,27.34 6.93,24.8 arc(6.81,24.54) 6.54,24.42 ; v1(24.75,19.22) arc(24.64,18.67) 24.33,18.21 21.49,15.36 arc(20.12,14.45) v1(18.51,14.13)
  Bottom Layer w0.2: R113.2 9.27,14.08 arc(8.87,14.25) v1(8.7,14.64) ; U35.64 23.75,12.04 arc(23.58,11.64) 23.18,11.47 20.39,11.47 arc(20.03,11.62) 19.88,11.98 v1(19.88,12.1) ; C138.1 35.71,10.83 v1(36.33,10.83) U20.9 ; v1(42.36,12.13) C139.1 41.3,12.33 U20.1 ; v1(34.49,9.18) 34.49,10.83 arc(34.3,11.28) 33.85,11.47 arc(33.43,11.65) 33.25,12.07 U29.33 ; U35.32 31.25,22.46 arc(31.01,21.87) 30.42,21.63 29.07,21.63 arc(28.23,21.28) 27.88,20.44 27.88,20.31 arc(27.56,19.54) 26.79,19.22 v1(24.75,19.22) U35.19 ; v1(40.84,11.22) 40.72,11.33 U20.3 ; v1(42.1,9.18) 39.18,9.18 arc(38.88,9.31) 38.75,9.62 U20.6 ; U35.1 arc(21.54,14.33) 21.05,14.13 v1(18.51,14.13) C167.1 C166.1 C165.1 C130.2 14.95,15.35 arc(14.95,15.35) v1(14.95,15.35)
VCC_POWER: length 3.6
  Top Layer w0.2: v1(17,9.31) U37.4
  Top Layer w0.6: v1(18.72,10.03) 18.9,9.86 USB2.11
  vias: v1(14.19,12.23) v1(14.21,10.03)
ADC_BUSY: length 9.9
  Top Layer w0.13: U29.14 v1(23.56,15.83)
  Bottom Layer w0.13: v1(23.56,15.83) 27.78,15.83 arc(28.82,15.4) 29.25,14.36 U35.53
ADC_CH0: length 19.5
  Top Layer w0.13: 46.31,26.25 46.31,25.58 45.05,24.32 arc(44.73,24.11) 44.34,24.03 43.31,24.03 arc(42.93,23.95) 42.6,23.74 42.41,23.54 arc(42.09,23.33) 41.71,23.25 37.89,23.25 arc(37.51,23.33) 37.18,23.54 35.97,24.76 arc(35.8,25.02) 35.74,25.32 35.74,25.53 arc(35.7,25.7) 35.61,25.85 35.44,26.01 arc(35.12,26.23) 34.74,26.3 32.58,26.3 arc(32.19,26.23) 31.87,26.01 31.54,25.68 arc(31.33,25.36) 31.25,24.97 U29.49
ADC_CH1: length 18.5
  Top Layer w0.13: U29.51 30.25,25.83 arc(30.31,26.13) 30.48,26.39 30.55,26.46 arc(30.81,26.63) 31.12,26.69 34.9,26.69 arc(35.28,26.62) 35.6,26.4 35.89,26.11 arc(36.07,25.85) 36.13,25.54 36.13,25.48 arc(36.19,25.18) 36.36,24.92 37.34,23.93 arc(37.67,23.72) 38.05,23.64 41.54,23.64 arc(41.93,23.72) 42.25,23.93 43.77,25.45 43.77,26.25
ADC_CH2: length 16.8
  Top Layer w0.13: 41.23,26.25 41.23,25.58 39.97,24.32 arc(39.65,24.11) 39.26,24.03 38.21,24.03 arc(37.83,24.11) 37.51,24.32 36.75,25.08 arc(36.58,25.34) 36.52,25.64 36.52,25.7 arc(36.46,26.01) 36.28,26.27 35.76,26.79 arc(35.44,27.01) 35.06,27.08 30.7,27.08 arc(30.32,27.01) 29.99,26.79 29.54,26.34 arc(29.33,26.02) 29.25,25.63 U29.53
ADC_CH3: length 13
  Top Layer w0.13: 38.69,26.25 37.27,26.25 arc(36.89,26.32) 36.56,26.54 35.92,27.18 arc(35.6,27.4) 35.21,27.47 30.21,27.47 arc(29.83,27.4) 29.5,27.18 28.47,26.14 arc(28.31,25.9) 28.25,25.62 U29.55
ADC_CH4: length 11.2
  Top Layer w0.13: U29.57 27.25,24.34 27.25,25.66 arc(27.19,25.97) 27.01,26.22 25.78,27.46 arc(25.45,27.67) 25.07,27.75 23.11,27.75 arc(22.73,27.67) 22.41,27.46 21.49,26.54 arc(21.16,26.32) 20.78,26.25 U47.9
ADC_CH5: length 14.8
  Top Layer w0.13: U47.7 16.31,25.47 17.46,24.32 arc(17.79,24.11) 18.17,24.03 19.12,24.03 arc(19.5,24.11) 19.82,24.32 22.57,27.07 arc(22.89,27.28) 23.28,27.36 24.66,27.36 arc(25.04,27.29) 25.36,27.07 25.96,26.47 arc(26.17,26.15) 26.25,25.77 U29.59
ADC_CH6: length 16.6
  Top Layer w0.13: U47.5 13.77,25.43 15.26,23.93 arc(15.59,23.72) 15.97,23.64 19.28,23.64 arc(19.66,23.72) 19.98,23.93 22.73,26.68 arc(23.05,26.9) 23.44,26.97 24.49,26.97 arc(24.68,26.93) 24.84,26.83 25.1,26.57 arc(25.21,26.4) 25.25,26.21 U29.61
ADC_CH7: length 15.8
  Top Layer w0.13: U47.3 11.23,25.45 12.36,24.32 arc(12.69,24.11) 13.07,24.03 14.2,24.03 arc(14.58,23.95) 14.91,23.74 15.1,23.54 arc(15.43,23.33) 15.81,23.25 19.61,23.25 arc(19.8,23.21) 19.97,23.11 20.03,23.05 arc(20.19,22.94) 20.38,22.9 23.61,22.9 arc(23.8,22.94) 23.96,23.05 24.1,23.19 arc(24.21,23.35) 24.25,23.54 U29.63
ADC_CONVST_A: length 2.9
  Top Layer w0.13: U29.9 v1(23.18,18.33)
  Bottom Layer w0.13: v1(23.18,18.33) U29.9
ADC_CONVST_B: length 5.5
  Top Layer w0.13: U29.10 20.65,17.83 arc(20.3,17.69) 20.16,17.34 20.16,15.34 arc(20.16,15.34) v1(20.17,15.33)
  Bottom Layer w0.13: U35.2 v1(20.17,15.33)
ADC_CS: length 10.6
  Top Layer w0.13: U29.13 v1(23.94,16.33)
  Bottom Layer w0.13: U35.52 29.75,14.16 arc(29.11,15.7) 27.58,16.33 v1(23.94,16.33)
ADC_DB0: length 4.7
  Top Layer w0.13: U29.16 v1(23.56,14.83)
  Bottom Layer w0.13: v1(23.56,14.83) 23.94,14.83 arc(24.51,14.59) 24.75,14.02 U35.62
ADC_DB7: length 5.5
  Top Layer w0.13: v1(26.43,14.84) 26.64,14.84 arc(27.07,14.66) 27.25,14.23 U29.24
  Bottom Layer w0.13: U35.61 25.25,14.27 arc(25.41,14.66) 25.81,14.83 26.42,14.83 arc(26.42,14.83) v1(26.43,14.84)
ADC_FRSTDATA: length 9.2
  Top Layer w0.13: U29.15 v1(23.18,15.33)
  Bottom Layer w0.13: U35.54 28.75,14.59 arc(28.53,15.11) 28.01,15.33 v1(23.18,15.33)
ADC_OS0: length 3
  Top Layer w0.13: U29.3 v1(20.26,21.33)
  Bottom Layer w0.13: v1(20.26,21.33) U29.3
ADC_OS1: length 4.6
  Top Layer w0.13: v1(23.69,19.83) 23.69,20.13 arc(23.48,20.63) 22.99,20.83 U29.4
  Bottom Layer w0.13: U35.11 v1(23.69,19.83)
ADC_OS2: length 3.7
  Top Layer w0.13: U29.5 22.83,20.33 arc(23.08,20.23) 23.18,19.98 v1(23.18,19.33)
  Bottom Layer w0.13: U35.10 v1(23.18,19.33)
ADC_RANGE: length 3.6
  Top Layer w0.13: U29.8 v1(23.56,18.83)
  Bottom Layer w0.13: U29.8 v1(23.56,18.83)
ADC_RD: length 11.3
  Top Layer w0.13: U29.12 v1(24.32,16.83)
  Bottom Layer w0.13: v1(24.32,16.83) 27.38,16.83 arc(29.41,15.99) 30.25,13.96 U35.51
ADC_RESET: length 12
  Top Layer w0.13: U29.11 v1(24.71,17.33)
  Bottom Layer w0.13: U35.50 30.75,13.86 arc(29.73,16.32) 27.28,17.33 v1(24.71,17.33)
BOOT0: length 32.5
  Top Layer w0.13: SW6.3 2.97,10.12 ; 2.97,10.12 R18.1 ; 2.97,10.12 4.4,10.12 arc(4.79,10.2) 5.11,10.42 7.84,13.14 arc(8.23,13.41) 8.7,13.5 17.85,13.5 arc(18.2,13.43) 18.5,13.23 18.75,13.23 v1(19.37,12.61)
  Bottom Layer w0.13: U35.60 25.75,10.35 arc(25.52,9.8) 24.96,9.56 20.26,9.56 arc(19.63,9.83) 19.37,10.45 v1(19.37,12.61)
DOWN: length 19
  Top Layer w0.13: C135.2 47.94,13.13 v1(47.17,13.89) SW4.6
  Bottom Layer w0.13: v1(47.17,13.89) 46.82,14.24 arc(46.66,14.35) 46.47,14.39 40.11,14.39 arc(39.72,14.47) 39.4,14.68 39.35,14.73 arc(39.13,15.06) 39.06,15.44 arc(38.94,16.02) 38.61,16.52 37.09,18.04 arc(36.76,18.26) 36.38,18.33 U35.41
IPS_BL: length 26.3
  Top Layer w0.13: R115.2 7.16,14.35 arc(7.65,14.03) 8.22,13.91 15.48,13.91 arc(16.05,14.03) 16.54,14.35 v1(17.59,15.41)
  Inner1 w0.13: v1(17.59,15.41) 18.05,15.41 arc(18.22,15.44) 18.36,15.53 22.89,20.07 arc(23.21,20.28) 23.6,20.36 25.2,20.36 arc(25.58,20.44) 25.91,20.65 v1(26.25,20.99)
  Bottom Layer w0.13: v1(26.25,20.99) U35.22
IPS_CS: length 20.6
  Top Layer w0.13: FPC1.8 v1(17.59,16.83)
  Inner1 w0.13: v1(25.25,20.87) 23.6,20.87 arc(23.21,20.79) 22.89,20.57 19.44,17.12 arc(19.11,16.91) 18.73,16.83 v1(17.59,16.83)
  Bottom Layer w0.13: v1(25.25,20.87) U35.20
IPS_DC: length 20.9
  Top Layer w0.13: FPC1.4 v1(18.86,18.83)
  Inner1 w0.13: v1(18.86,18.83) 19.29,18.83 arc(19.6,18.89) 19.86,19.07 22.89,22.1 arc(23.21,22.32) 23.6,22.39 v1(27.25,22.39)
  Bottom Layer w0.13: v1(27.25,22.39) 27.25,24.33 U35.24
IPS_RESET: length 20.9
  Top Layer w0.13: FPC1.3 v1(18.48,19.33)
  Inner1 w0.13: v1(27.75,22.9) 23.6,22.9 arc(23.21,22.82) 22.89,22.61 19.91,19.62 arc(19.58,19.41) 19.2,19.33 v1(18.48,19.33)
  Bottom Layer w0.13: v1(27.75,22.9) U35.25
IPS_SCL: length 20.4
  Top Layer w0.13: FPC1.6 v1(18.86,17.83)
  Inner1 w0.13: v1(18.86,17.83) 19.39,17.83 arc(19.62,17.88) 19.81,18.01 22.89,21.08 arc(23.21,21.3) 23.6,21.38 v1(25.75,21.38)
  Bottom Layer w0.13: v1(25.75,21.38) U35.21
IPS_SDA: length 20.9
  Top Layer w0.13: FPC1.5 v1(18.48,18.33)
  Inner1 w0.13: v1(26.75,21.88) 23.6,21.88 arc(23.21,21.81) 22.89,21.59 19.92,18.62 arc(19.6,18.41) 19.22,18.33 v1(18.48,18.33)
  Bottom Layer w0.13: v1(26.75,21.88) U35.23
LEFT: length 14.6
  Top Layer w0.13: SW4.3 40.37,19.5 arc(40.15,19.18) 40.07,18.8 v1(40.07,16.7) 40.07,15.28 arc(40,14.91) 39.78,14.61 39.46,14.28 C134.1
  Bottom Layer w0.13: U35.39 36.62,19.33 arc(37.01,19.26) 37.33,19.04 39.58,16.79 arc(39.68,16.73) 39.79,16.7 v1(40.07,16.7)
NRST: length 27.2
  Top Layer w0.13: R20.1 v1(5.57,22.81) 5.57,24.39 4.86,25.1 arc(4.65,25.23) 4.41,25.28 SW5.4 2.97,27.15 arc(2.85,27.46) C34.2
  Inner1 w0.13: v1(18.1,19.85) 14.32,19.85 arc(14.06,19.8) 13.84,19.65 arc(13.64,19.52) 13.4,19.47 11.4,19.47 arc(10.9,19.57) 10.48,19.85 arc(10.29,20.13) 10.23,20.46 10.23,20.96 arc(10.13,21.46) 9.85,21.88 9.35,22.38 arc(8.88,22.7) 8.32,22.81 v1(5.57,22.81)
  Bottom Layer w0.13: v1(18.1,19.85) 18.61,19.85 arc(19.6,19.44) 20.01,18.45 arc(20.19,18.01) 20.63,17.83 U35.7
OSC_32_IN: length 13.1
  Bottom Layer w0.13: X2.1 10.01,16.31 arc(10.82,16.47) 11.5,16.92 11.58,16.92 12.1,17.44 15.04,17.44 arc(15.87,17.28) 16.58,16.8 17.01,16.37 arc(17.49,16.05) 18.05,15.94 20.58,15.94 20.69,15.83 U35.3
OSC_32_OUT: length 13.1
  Bottom Layer w0.13: U35.4 20.69,16.33 20.58,16.22 18.11,16.22 arc(17.6,16.32) 17.17,16.61 16.78,17 arc(15.98,17.54) 15.04,17.72 12.1,17.72 11.59,18.24 11.5,18.24 arc(10.82,18.7) 10.01,18.86 X2.2
OSC_IN: length 13
  Bottom Layer w0.13: 13.37,21.46 11.67,21.46 arc(11.55,21.51) C60.1 ; 13.37,21.46 X1.1 arc(14.12,21.16) 14.42,20.44 14.42,19.47 arc(14.64,18.93) 15.18,18.71 15.94,18.71 arc(16.28,18.64) 16.57,18.45 17.43,17.59 arc(18.14,17.11) 18.99,16.94 20.58,16.94 20.69,16.83 U35.5 ; 13.37,21.46 arc(13.37,21.46) 13.37,21.46
OSC_OUT: length 13
  Bottom Layer w0.13: U35.6 20.69,17.33 20.58,17.22 18.99,17.22 arc(18.25,17.37) 17.63,17.79 17.21,18.21 arc(17.17,18.3) 17.21,18.39 17.69,18.87 arc(17.69,19.05) 17.51,19.05 17.03,18.57 arc(16.94,18.53) 16.85,18.57 16.75,18.66 arc(16.72,18.75) 16.75,18.84 17.23,19.32 arc(17.23,19.49) 17.05,19.49 16.57,19.02 arc(16.48,18.98) 16.4,19.02 16.19,19.22 arc(16.05,19.32) 15.89,19.35 15.65,19.35 15.6,19.39 X1.3 arc(15.84,20.29) 16.43,20.54 C61.2
OTG_D+: length 26.3
  Top Layer w0.13: USB2.6 v1(16.25,8.14) 16.25,8.8 ; U37.2 16,9.88 arc(16.02,9.76) 16.09,9.66 16.16,9.59 arc(16.23,9.49) 16.25,9.38 16.25,8.8 ; 16.25,8.8 arc(16.25,8.8) 16.25,8.8 17.09,8.8 arc(17.27,8.73) 17.34,8.55 17.34,7.45 arc(17.31,7.38) USB2.8
  Inner1 w0.13: v1(16.25,8.14) 16.55,7.84 17.16,7.84 17.49,8.18 21.29,8.18 arc(22.01,8.32) 22.62,8.73 24.29,10.39 arc(24.38,10.43) 24.47,10.39 arc(24.65,10.39) 24.65,10.57 arc(24.61,10.66) 24.65,10.75 30.34,16.44 30.4,16.44 30.51,16.33 v1(31.18,16.33)
  Bottom Layer w0.13: U35.45 v1(31.18,16.33)
OTG_D-: length 26.3
  Top Layer w0.13: USB2.5 v1(15.75,8.57) 15.75,9.38 arc(15.73,9.49) 15.66,9.59 15.59,9.66 arc(15.52,9.76) 15.5,9.88 U37.1 ; v1(16.83,8.29) 16.83,7.44 arc(16.81,7.38) USB2.7
  Inner1 w0.13: v1(15.75,8.57) 15.97,8.79 17.16,8.79 17.49,8.46 21.24,8.46 arc(21.9,8.59) 22.47,8.97 30.18,16.68 arc(30.23,16.71) 30.28,16.72 30.4,16.72 30.51,16.83 v1(30.8,16.83)
  Bottom Layer w0.13: v1(30.8,16.83) U35.44 ; v1(15.75,8.57) arc(15.78,8.64) 15.86,8.68 16.45,8.68 arc(16.72,8.56) v1(16.83,8.29)
PRRESS: length 14.2
  Top Layer w0.13: C136.2 39.31,16.84 arc(39.5,17.13) v1(39.56,17.47) 39.56,20.07 arc(39.64,20.46) 39.86,20.78 40.29,21.21 arc(40.61,21.43) 41,21.5 41.62,21.5 41.99,21.13
  Bottom Layer w0.13: v1(39.56,17.47) 37.5,19.54 arc(37.17,19.76) 36.79,19.83 U35.38
RIGHT: length 21.6
  Top Layer w0.13: 49.93,14.82 49.93,15.17 v1(49.57,15.53) SW4.4
  Bottom Layer w0.13: U35.40 36.49,18.83 arc(36.87,18.76) 37.19,18.54 39.02,16.71 arc(39.42,16.11) 39.56,15.4 arc(39.6,15.21) 39.71,15.05 39.74,15.02 arc(39.91,14.91) 40.1,14.87 48.49,14.87 arc(48.87,14.95) 49.2,15.16 v1(49.57,15.53)
RXD: length 21
  Bottom Layer w0.13: U20.4 39.95,10.33 40.08,10.2 40.08,10.08 arc(40.09,10.06) 40.11,10.05 42.59,10.05 arc(42.97,10.21) 43.12,10.58 43.12,13.12 arc(42.97,13.48) 42.61,13.63 arc(42.52,13.59) 42.49,13.5 42.49,13.38 arc(42.36,13.25) 42.23,13.38 42.23,13.5 arc(42.19,13.59) 42.1,13.63 41.77,13.63 arc(41.68,13.59) 41.64,13.5 41.64,13.38 arc(41.51,13.25) 41.38,13.38 41.38,13.5 arc(41.35,13.59) 41.26,13.63 37.25,13.63 arc(36.35,14) 35.98,14.9 35.98,16.83 arc(35.8,17.26) 35.37,17.44 34.38,17.44 34.27,17.33 U35.43
SWCLK: length 2.8
  Bottom Layer w0.13: U48.1 U35.49
SWDIO: length 7.4
  Bottom Layer w0.13: U35.46 32.36,15.83 arc(32.05,15.7) 31.93,15.39 31.93,11.87 arc(32.04,11.59) 32.33,11.47 arc(32.63,11.35) 32.75,11.05 U49.1
TTL_D+: length 6.5
  Top Layer w0.13: U38.2 38,9.43 arc(38.04,9.24) 38.15,9.08 v1(38.42,8.8) ; v1(38.42,8.8) 38.93,8.8 arc(39.05,8.78) 39.15,8.71 39.16,8.7 arc(39.23,8.6) 39.25,8.49 USB3.8 ; v1(38.42,8.8) 38.32,8.7 arc(38.27,8.62) 38.25,8.53 USB3.6
  Bottom Layer w0.13: v1(38.42,8.8) 38.25,8.97 U20.7
TTL_D-: length 6.7
  Top Layer w0.13: U38.1 37.5,8.58 v1(37.53,8.55) 37.53,8.29 arc(37.56,8.18) 37.62,8.08 37.66,8.04 arc(37.73,7.94) 37.75,7.83 USB3.5 ; 38.75,8.21 USB3.7
  Bottom Layer w0.13: v1(38.75,8.21) 37.99,8.21 arc(37.88,8.24) 37.78,8.3 v1(37.53,8.55) 37.66,8.68 arc(37.73,8.78) 37.75,8.89 U20.8
TXD: length 21
  Bottom Layer w0.13: U20.5 39.75,10.13 39.8,10.08 arc(39.89,9.86) 40.11,9.77 42.59,9.77 arc(43.17,10.01) 43.4,10.58 43.4,13.12 arc(43.17,13.68) 42.61,13.91 37.25,13.91 arc(36.55,14.2) 36.26,14.9 36.26,16.83 arc(36,17.46) 35.37,17.72 34.38,17.72 34.27,17.83 U35.42
UP: length 11.3
  Top Layer w0.13: C72.1 39.61,21.58 arc(39.76,21.61) 39.89,21.7 40.54,22.35 arc(40.87,22.57) 41.25,22.65 42.45,22.65 SW4.1 ; R106.1 38.93,20.58 v1(38.93,20.11)
  Bottom Layer w0.13: U35.37 37.06,20.33 arc(37.44,20.26) 37.76,20.04 38.06,19.74 arc(38.22,19.64) 38.41,19.6 38.55,19.6 arc(38.67,19.62) 38.77,19.69 arc(38.89,19.87) 38.93,20.08 v1(38.93,20.11)
USER: length 24.9
  Top Layer w0.13: R104.2 v1(33.43,28.74)
  Inner1 w0.13: v1(33.43,28.74) 33.43,20.36 arc(32.91,19.1) 31.65,18.58 25.88,18.58
  Bottom Layer w0.13: v1(25.88,18.58) 25.09,18.58 arc(24.46,18.84) 24.2,19.47 24.2,20.87 arc(23.92,21.55) 23.23,21.83 U35.15
$1N3863: length 9.2
  Top Layer w0.2: R77.1 13.43,12.47 arc(13.47,12.66) 13.58,12.82 13.6,12.85 arc(13.76,12.96) 13.96,12.99 14.37,12.99 arc(14.56,12.96) 14.72,12.85 14.73,12.84 arc(14.84,12.68) 14.88,12.48 14.88,9.92 arc(14.92,9.73) 15.02,9.56 15.08,9.51 arc(15.19,9.34) 15.23,9.15 15.23,7.35
$1N3864: length 5.3
  Top Layer w0.2: R78.1 19.21,10.94 arc(19.04,11.05) 18.85,11.09 18.56,11.09 arc(18.37,11.05) 18.21,10.94 18.12,10.85 arc(18.01,10.69) 17.97,10.5 17.97,9.56 arc(18,9.45) 18.06,9.35 18.16,9.25 arc(18.23,9.15) 18.25,9.04 USB2.10
$1N14437: length 7.3
  Inner1 w0.13: v1(30.42,27.98) 30.42,23.23 arc(30.52,23) v1(30.75,22.9)
  Bottom Layer w0.13: v1(30.42,27.98) 30.42,28.58 ; U35.31 v1(30.75,22.9)
$1N15249: length 4.3
  Top Layer w0.13: R101.1 35.43,9.46 arc(35.47,9.27) 35.58,9.11 35.86,8.82 arc(36.02,8.71) 36.22,8.68 36.44,8.68 arc(36.63,8.64) 36.79,8.53 37.1,8.22 arc(37.21,8.05) 37.25,7.86 USB3.4
$1N15250: length 3.7
  Top Layer w0.13: R102.1 41.57,10.12 arc(41.53,9.93) 41.42,9.77 40.54,8.89 arc(40.33,8.57) 40.25,8.18 USB3.10
$1N20405: length 2.9
  Top Layer w0.13: LED6.6 R84.1
$1N20444: length 2.9
  Top Layer w0.13: LED6.5 R103.1
$1N20483: length 2.9
  Top Layer w0.13: LED6.4 R104.1
$1N20665: length 2.9
  Top Layer w0.13: SW4.5 47.01,15.96 R79.2
$1N21331: length 7.1
  Inner1 w0.13: v1(29.25,27.98) v1(29.25,22.9)
  Bottom Layer w0.13: U35.28 v1(29.25,22.9) ; v1(29.25,27.98) R111.1
$1N23387: length 4.6
  Top Layer w0.13: v1(34.7,15.33) v1(36.74,15.33)
  Bottom Layer w0.13: v1(34.7,15.33) U35.47 ; C137.1 37.28,14.79 arc(37.27,14.78) 37.26,14.77 37.15,14.77 arc(36.86,14.89) 36.74,15.18 v1(36.74,15.33)
$1N29515: length 2.7
  Top Layer w0.13: R97.1 5.01,20.52 Q1.3
$1N29540: length 3.6
  Top Layer w0.13: R115.1 R116.2 5.57,16.97 6.23,17.63 Q1.1
$2N5032: length 5.4
  Top Layer w0.13: U29.36 32.44,16.33 arc(32.24,16.29) 32.08,16.19 32.07,16.17 arc(31.96,16.01) 31.92,15.82 31.92,14.78 arc(32,14.4) 32.22,14.07 33.6,12.68
$2N5113: length 9.6
  Top Layer w0.13: C105.1 34.87,12.45 arc(34.34,12.1) 33.72,11.98 arc(33.37,12.05) 33.07,12.25 32.59,12.73 arc(31.99,13.57) 31.71,14.56 arc(31.69,14.67) 31.69,14.78 31.69,17.08 arc(31.76,17.41) 31.94,17.69 arc(32.1,17.8) 32.28,17.83 U29.39
$2N5155: length 9.8
  Top Layer w0.13: 33.24,19.34 U29.42 32.28,19.33 arc(32.1,19.37) 31.94,19.47 arc(31.76,19.75) 31.69,20.08 31.69,22.41 arc(31.92,23.57) 32.58,24.55 33.07,25.04 arc(33.37,25.24) 33.72,25.31 arc(34.23,25.21) 34.66,24.93 C106.1
$2N5232: length 7.5
  Top Layer w0.13: U29.44 32.43,20.33 arc(32.24,20.37) 32.08,20.48 32.07,20.49 arc(31.96,20.65) 31.92,20.84 31.92,21.37 ; 31.92,21.37 31.92,22.36 arc(32,22.74) 32.22,23.07 C107.1 ; 31.92,21.37 arc(31.95,21.26) 32.01,21.16 32.19,20.98 arc(32.36,20.87) 32.55,20.83 U29.45

## Copper pours and planes (outline as drawn; the poured copper is in the pictures)
AGND on Top Layer: 6.99,23.11 6.99,37.07 48.01,37.07 48.01,23.43 39.17,23.43 38.07,22.33 38.07,13.97 31.69,7.59 25.47,7.59 19.02,14.04 19.02,18.03 13.93,23.11
AGND on Top Layer: 26.56,6.85 27.35,6.85 27.35,5.31 26.56,5.31
AGND on Bottom Layer: 38.04,16.32 35.64,13.91 20.36,13.91 18.99,15.28 18.99,17.79 19,17.8 14.78,22.02 8.07,22.02 6.99,23.11 6.99,37.07 47.99,37.14 47.99,26.18 43.27,21.46 39.18,21.46 38.03,20.32 38.03,16.33
AGND on Inner2: 6.99,23.11 6.99,37.03 48.01,37.03 48.01,23.43 39.16,23.43 38.06,22.33 38.06,13.8 31.69,7.42 25.47,7.42 19.02,13.88 19.02,18.03 13.93,23.11
AVCC on Top Layer: 18.65,22.6 19.6,22.6 19.6,20.64 18.65,20.64
AVCC on Top Layer: 27.93,9.7 30.08,9.7 30.08,7.49 27.93,7.49
AVCC on Top Layer: 27.93,9.19 32.1,9.19 32.1,7.98 27.93,7.98
AVCC on Top Layer: 27.65,9.69 29.13,9.69 29.13,6.33 27.65,6.33
AVCC on Top Layer: 36.05,18.43 38.06,18.43 38.06,17.48 36.05,17.48
AVCC on Inner1: 6.99,23.11 6.87,37.1 47.99,37.14 48.01,23.43 39.16,23.43 38.07,22.33 38.07,13.92 31.65,7.5 25.42,7.5 19.01,13.92 19.02,18.03 16.2,20.87 13.93,23.11
DGND on Top Layer: -8.51,44.93 62.45,44.93 62.45,-6.23 -8.51,-6.23
DGND on Top Layer: 33.15,33.35 33.72,33.35 33.72,31.31 33.15,31.31
DGND on Bottom Layer: 14.68,11.52 18.23,11.52 18.23,10.73 14.68,10.73
DGND on Bottom Layer: 11.61,11.55 14.68,11.55 14.68,10.73 11.61,10.73
DGND on Bottom Layer: -8.25,44.68 62.71,44.68 62.71,-6.49 -8.25,-6.49
DGND on Inner2: -8.49,44.95 62.45,44.95 62.45,-6.23 -8.49,-6.23
DVCC on Top Layer: 24.17,32.07 26.42,32.07 26.42,29.59 24.17,29.59
DVCC on Bottom Layer: 5.05,14.85 6.35,14.85 6.35,9.35 5.05,9.35
DVCC on Bottom Layer: 2.56,11.1 6.14,11.1 6.14,9.8 2.56,9.8
DVCC on Bottom Layer: 5.56,16.35 6.71,16.35 6.71,14.31 5.56,14.31
DVCC on Inner1: -8.51,44.93 62.45,44.93 62.45,-6.24 -8.51,-6.24
VCC_POWER on Top Layer: 18.6,9.68 27.07,9.68 27.07,7.49 18.6,7.49
VCC_POWER on Top Layer: 13.8,9.96 14.52,9.96 14.52,7.06 13.8,7.06
VCC_POWER on Top Layer: 13.87,12.49 14.52,12.49 14.52,9.64 13.87,9.64
VCC_POWER on Bottom Layer: 11.62,12.49 14.52,12.49 14.52,11.97 11.62,11.97
VCC_POWER on Bottom Layer: 13.87,10.43 19.1,10.43 19.1,9.64 13.87,9.64
VCC_POWER on Bottom Layer: 9.32,12.5 12.68,12.5 12.68,10.07 9.32,10.07
DOWN on Top Layer: 47,13.59 48.54,13.59 48.54,11.9 47,11.9
LEFT on Top Layer: 38.65,14.55 39.44,14.55 39.44,13.02 38.65,13.02
PRRESS on Top Layer: 38.65,16.85 39.43,16.85 39.43,15.31 38.65,15.31
RIGHT on Top Layer: 49.54,16.13 51.08,16.13 51.08,14.44 49.54,14.44
UP on Top Layer: 38.65,21.85 39.44,21.85 39.44,20.31 38.65,20.31
$1N27774 on Top Layer: 21.62,7.11 22.63,7.11 22.63,1.1 21.62,1.1
$1N27774 on Top Layer: 21.62,4.63 24.27,4.63 24.27,3.84 21.62,3.84
$1N27783 on Top Layer: 8.73,4.63 11.38,4.63 11.38,3.85 8.73,3.85
$1N27783 on Top Layer: 10.38,7.12 11.38,7.12 11.38,1.11 10.38,1.11
$1N27801 on Top Layer: 43.62,7.11 44.62,7.11 44.62,1.1 43.62,1.1
$1N27801 on Top Layer: 43.62,4.63 46.27,4.63 46.27,3.84 43.62,3.84
$1N27807 on Top Layer: 32.38,7.11 33.38,7.11 33.38,1.1 32.38,1.1
$1N27807 on Top Layer: 30.73,4.63 33.38,4.63 33.38,3.85 30.73,3.85
$3N1518 on Bottom Layer: 6.85,11.55 12.68,11.55 12.68,9.36 6.85,9.36
$3N2588 on Bottom Layer: 6.65,14.85 9.35,14.85 9.35,11.97 6.65,11.97
$3N2588 on Bottom Layer: 9.31,14.35 11.84,14.35 11.84,11.97 9.31,11.97

Small or netless copper shapes (teardrops, artwork), in the pictures only: 248 on Top Layer, 171 on Bottom Layer, 28 on Inner1, 3 on Inner2

## Text on the board
Bottom Solder Mask Layer: V1.3
Bottom Silkscreen Layer: STM32F4 | 8CH | aDC | CARD
Top Silkscreen Layer: aD7606 | POWER | TTL | RESET | BOOT | CH 5-8 | CH 1-4
